# Altium schematic sheet Ethernet.SchDoc: Ethernet
size A4; Date: 01-DEC-2013; CompanyName: STMicroelectronics; Organization: Microcontrollers Division; Address1: 12, Rue Jules HOROWITZ; Address2: 38019 Grenoble; Address3: FRANCE; DocumentNumber: MB1272; Revision: A-01; SheetNumber: 12; SheetTotal: 15; Project: STM32MP15-DISCO PI
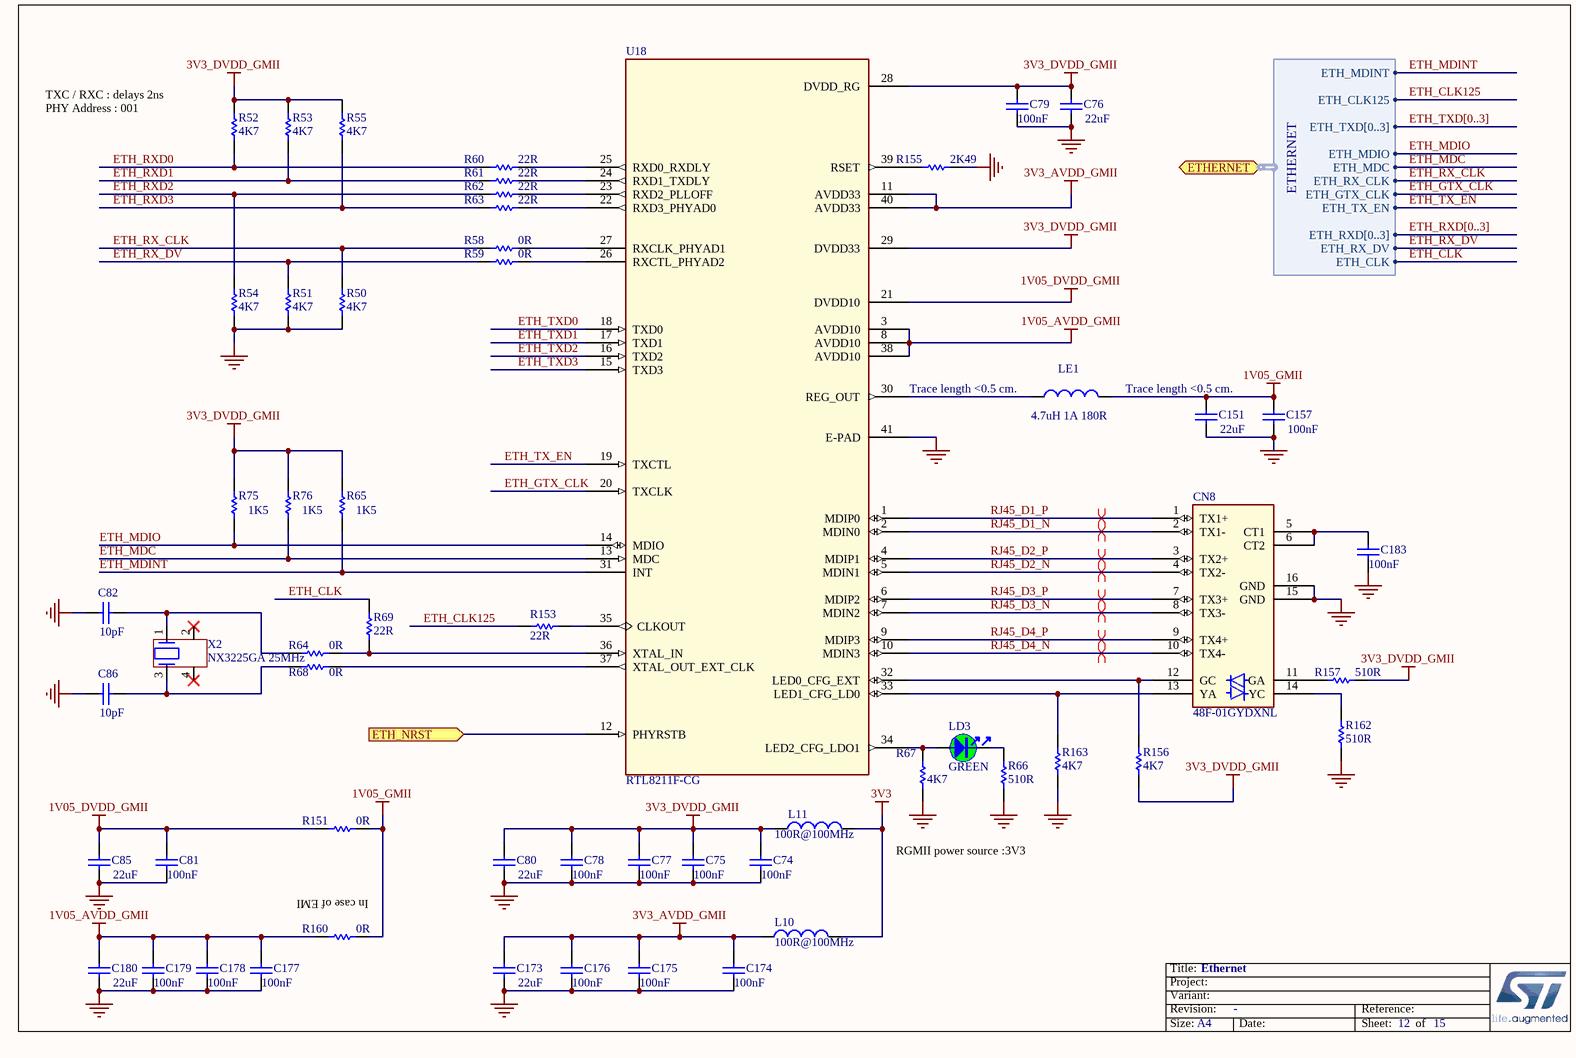
[diagram p0: Ethernet.SchDoc]

## Parts
C74  value 100nF  [C0402]
C75  value 100nF  [C0402]
C76  value 22uF  [C0603]
C77  value 100nF  [C0402]
C78  value 100nF  [C0402]
C79  value 100nF  [C0402]
C80  value 22uF  [C0603]
C81  value 100nF  [C0402]
C82  value 10pF  [C0402]
C85  value 22uF  [C0603]
C86  value 10pF  [C0402]
C151  value 22uF  [C0603]
C157  value 100nF  [C0402]
C173  value 22uF  [C0603]
C174  value 100nF  [C0402]
C175  value 100nF  [C0402]
C176  value 100nF  [C0402]
C177  value 100nF  [C0402]
C178  value 100nF  [C0402]
C179  value 100nF  [C0402]
C180  value 22uF  [C0603]
C183  value 100nF  [C0402]
CN8  value 48F-01GYDXNL  [CON_RJ45_YD_48F-01GYDXNL_LED-P]  (hidden comment: ​New part for use of led pulled down on pin 13/14 , schematic more lisible.)
L10  value 100R@100MHz  [FIL_0603_H0P65]
L11  value 100R@100MHz  [FIL_0603_H0P65]
LD3  value GREEN  [LED_0603_GREEN]
LE1  value 4.7uH 1A 180R  [L1210_LQH]
R50  value 4K7  [R0402]
R51  value 4K7  [R0402]
R52  value 4K7  [R0402]
R53  value 4K7  [R0402]
R54  value 4K7  [R0402]
R55  value 4K7  [R0402]
R58  value 0R  [R0402]
R59  value 0R  [R0402]
R60  value 22R  [R0402]
R61  value 22R  [R0402]
R62  value 22R  [R0402]
R63  value 22R  [R0402]
R64  value 0R  [R0402]
R65  value 1K5  [R0402]
R66  value 510R  [R0402]
R67  value 4K7  [R0402]
R68  value 0R  [R0402]
R69  value 22R  [R0402]
R75  value 1K5  [R0402]
R76  value 1K5  [R0402]
R151  value 0R  [R0603]
R153  value 22R  [R0402]
R155  value 2K49  [R0402]
R156  value 4K7  [R0402]
R157  value 510R  [R0402]
R160  value 0R  [R0603]
R162  value 510R  [R0402]
R163  value 4K7  [R0402]
U18  RTL8211F-CG  [ICC_QFN40-EPAD_5X5_P040]
X2  value NX3225GA 25MHz  [CRY_NX3225HA_4P]  (hidden comment: XTAL_4_PINS)

## Ports
ETH_NRST (in), ETHERNET (harness ETHERNET)

## Harnesses
ETHERNET: ETH_MDINT, ETH_CLK125, ETH_TXD[0..3], ETH_MDIO, ETH_MDC, ETH_RX_CLK, ETH_GTX_CLK, ETH_TX_EN, ETH_RXD[0..3], ETH_RX_DV, ETH_CLK

## Nets
1V05_AVDD_GMII: C177.2 C178.2 C179.2 C180.2 R160.1 U18.3(AVDD10) U18.8(AVDD10) U18.38(AVDD10)
1V05_DVDD_GMII: C81.2 C85.2 R151.1 U18.21(DVDD10)
1V05_GMII: C151.2 C157.2 LE1.2 R151.2 R160.2
3V3: L10.2 L11.2
3V3_AVDD_GMII: C173.2 C174.2 C175.2 C176.2 L10.1 U18.11(AVDD33) U18.40(AVDD33)
3V3_DVDD_GMII: C74.2 C75.2 C76.1 C77.2 C78.2 C79.2 C80.2 L11.1 R52.2 R53.2 R55.2 R65.2 R75.2 R76.2 R156.1 R157.2 U18.28(DVDD_RG) U18.29(DVDD33)
GND: C74.1 C75.1 C76.2 C77.1 C78.1 C79.1 C80.1 C81.1 C82.1 C85.1 C86.1 C151.1 C157.1 C173.1 C174.1 C175.1 C176.1 C177.1 C178.1 C179.1 C180.1 C183.1 CN8.15(GND) CN8.16(GND) R50.1 R51.1 R54.1 R66.1 R67.1 R155.2 R162.1 R163.1 U18.41(E-PAD)
ETH_CLK: R69.2 ; port ETHERNET.ETH_CLK
ETH_CLK125: R153.1 ; port ETHERNET.ETH_CLK125
ETH_GTX_CLK: U18.20(TXCLK) ; port ETHERNET.ETH_GTX_CLK
ETH_MDC: R76.1 U18.13(MDC) ; port ETHERNET.ETH_MDC
ETH_MDINT: R65.1 U18.31(INT) ; port ETHERNET.ETH_MDINT
ETH_MDIO: R75.1 U18.14(MDIO) ; port ETHERNET.ETH_MDIO
ETH_NRST: U18.12(PHYRSTB) ; port ETH_NRST
ETH_RX_CLK: R50.2 R58.1 ; port ETHERNET.ETH_RX_CLK
ETH_RX_DV: R51.2 R59.1 ; port ETHERNET.ETH_RX_DV
ETH_RXD0: R52.1 R60.1
ETH_RXD1: R53.1 R61.1
ETH_RXD2: R54.2 R62.1
ETH_RXD3: R55.1 R63.1
ETH_TX_EN: U18.19(TXCTL) ; port ETHERNET.ETH_TX_EN
ETH_TXD0: U18.18(TXD0)
ETH_TXD1: U18.17(TXD1)
ETH_TXD2: U18.16(TXD2)
ETH_TXD3: U18.15(TXD3)
RJ45_D1_N: CN8.2(TX1-) U18.2(MDIN0)
RJ45_D1_P: CN8.1(TX1+) U18.1(MDIP0)
RJ45_D2_N: CN8.4(TX2-) U18.5(MDIN1)
RJ45_D2_P: CN8.3(TX2+) U18.4(MDIP1)
RJ45_D3_N: CN8.8(TX3-) U18.7(MDIN2)
RJ45_D3_P: CN8.7(TX3+) U18.6(MDIP2)
RJ45_D4_N: CN8.10(TX4-) U18.10(MDIN3)
RJ45_D4_P: CN8.9(TX4+) U18.9(MDIP3)
NetC82_2: C82.2 R64.1 X2.1
NetC86_2: C86.2 R68.1 X2.3
NetC183_2: C183.2 CN8.5(CT1) CN8.6(CT2)
NetCN8_11: CN8.11(GA) R157.1
NetCN8_12: CN8.12(GC) R156.2 U18.32(LED0_CFG_EXT)
NetCN8_13: CN8.13(YA) R163.2 U18.33(LED1_CFG_LD0)
NetCN8_14: CN8.14(YC) R162.2
NetLD3_1: LD3.1 R67.2 U18.34(LED2_CFG_LDO1)
NetLD3_2: LD3.2 R66.2
NetLE1_1: LE1.1 U18.30(REG_OUT)
NetR58_2: R58.2 U18.27(RXCLK_PHYAD1)
NetR59_2: R59.2 U18.26(RXCTL_PHYAD2)
NetR60_2: R60.2 U18.25(RXD0_RXDLY)
NetR61_2: R61.2 U18.24(RXD1_TXDLY)
NetR62_2: R62.2 U18.23(RXD2_PLLOFF)
NetR63_2: R63.2 U18.22(RXD3_PHYAD0)
NetR64_2: R64.2 R69.1 U18.36(XTAL_IN)
NetR68_2: R68.2 U18.37(XTAL_OUT_EXT_CLK)
NetR153_2: R153.2 U18.35(CLKOUT)
NetR155_1: R155.1 U18.39(RSET)

Not connected (* = marked no-connect by the designer): X2 2* 4*

## Buses and harness runs
bus ETH_RXD[0..3]
bus ETH_TXD[0..3]

## Layout directives
differential pair: RJ45_D1_N, RJ45_D1_P, RJ45_D2_N, RJ45_D2_P, RJ45_D3_N, RJ45_D3_P, RJ45_D4_N, RJ45_D4_P

## Notes on the sheet
- (near R52) TXC / RXC : delays 2ns
  PHY Address : 001
- (near LE1) Trace length <0.5 cm.
- (near C151) Trace length <0.5 cm.
- (near R160) In case of EMI
- RGMII power source :3V3
- Title:
- Project:
- Size:
- Revision:
- Variant:
- A4
- -
- Date:
- Reference:
- Sheet:
- of

## Library data of the parts
C74 C75 C77-C79 C81 C157 C174-C179 C183 = MCD-00006: Capacitor,100nF,16V,X7R,10%,0402; Manufacturer_Part_Number: CC0402KRX7R7BB104; Manufacturer: YAGEO; Alternate_Manufacturer: MURATA; Alternate_Manufacturer_Part_Number: GCM155R71C104KA55D; Provided_By: SUBCO; Initial_Board_Reference: mb1274; Internal_Part_Number: MCD-00006; ComponentLink1Description: Datasheet; ECCN_US: n/a; ECCN_EU: n/a; Status: Released; Part_Type: Capacitor; Package: C0402; ComponentLink1URL: http://tunmcdsvn.tun.st.com/Component_Datasheet_Library/Trunk/Capacitors/Yageo_Multilayer_Capacitor_X7R_series_100pF_to_22uF
C76 C80 C85 C151 C173 C180 = MCD-00100: Capacitor,22uF,6V3,X5R,20%,0603; Manufacturer_Part_Number: GRM188R60J226MEA0J; Manufacturer: MURATA; ECCN_US: EAR99; ECCN_EU: NEC; Provided_By: SUBCO; Initial_Board_Reference: mb1262; Internal_Part_Number: MCD-00100; ComponentLink1Description: Datasheet; Status: Released; Part_Type: Capacitor; Package: C0603; ComponentLink1URL: http://tunmcdsvn.tun.st.com/Component_Datasheet_Library/Trunk/Capacitors/Murata_Capacitor_GR_series
C82 C86 = MCD-00015: Capacitor,10pF,50V,NPO,5%,0402; Manufacturer_Part_Number: CC0402JRNPO9BN100; Manufacturer: YAGEO; Provided_By: SUBCO; Initial_Board_Reference: mb1274; Internal_Part_Number: MCD-00015; ComponentLink1Description: Datasheet; ECCN_US: n/a; ECCN_EU: n/a; Status: Released; Part_Type: Capacitor; Package: C0402; ComponentLink1URL: http://tunmcdsvn.tun.st.com/Component_Datasheet_Library/Trunk/Capacitors/Yageo_Capacitor_NP0_16V-to-50V
CN8 = MCD-01129: Connector RJ45 with Gigabit magnetics and LED , led pull down; Manufacturer: YUAN DEAN SCIENTIFIC; Provided_By: SUBCO; Initial_Board_Reference: MB1272; Internal_Part_Number: MCD-01129; Manufacturer_Part_Number: 48F-01GYDXNL; ComponentLink1Description: Datasheet; Status: Footprint available; Part_Type: Connector; ECCN_US: n/a; ECCN_EU: n/a; ComponentLink1URL: http://tunmcdsvn.tun.st.com/Component_Datasheet_Library/Trunk/Connectors/YuanDean_RJ45_48Fseries/
L10 L11 = MCD-00094: Ferrite bead 100R 2A 0603; Manufacturer_Part_Number: BLM18EG101TN1; Manufacturer: MURATA; Part_Type: Inductor; ECCN_US: EAR99; ECCN_EU: NEC; Provided_By: SUBCO; Initial_Board_Reference: mb1262; Internal_Part_Number: MCD-00094; ComponentLink1Description: Datasheet; Status: Released; ComponentLink1URL: http://tunmcdsvn.tun.st.com/Component_Datasheet_Library/Trunk/Inductors/Murata_EMI_Filters_BLM
LD3 = MCD-00050: LED, Green, 0603; Manufacturer_Part_Number: 19-213SYGC/S530-E2/TR8; Manufacturer: EVERLIGHT; Part_Type: Display; ECCN_US: EAR99; ECCN_EU: NEC; Provided_By: SUBCO; Initial_Board_Reference: mb1274; Internal_Part_Number: MCD-00050; ComponentLink1Description: Datasheet; Status: Released; ComponentLink1URL: http://tunmcdsvn.tun.st.com/Component_Datasheet_Library/Trunk/Display/Everlight_SMD-LED-GREEN_19-213SYGC-S530-XX-TR8-v3.doc; Package: LED 0603
LE1 = MCD-00048: FIXED IND 4.7UH 1A 180 MOHM 30% SMD; Manufacturer_Part_Number: LQH32PN4R7NN0L; Manufacturer: MURATA; Provided_By: SUBCO; Initial_Board_Reference: mb1274; Internal_Part_Number: MCD-00048; ComponentLink1Description: Datasheet; ECCN_US: n/a; ECCN_EU: n/a; Status: Released; Part_Type: Inductor; ComponentLink1URL: http://tunmcdsvn.tun.st.com/Component_Datasheet_Library/Trunk/Inductors/Murata_Inductor_LQH32PN4R7NN0L
R50-R55 R67 R156 R163 = MCD-00065: Resistor,4K7,0402,1%,1/16W; Manufacturer_Part_Number: RC0402FR-074K7L; Manufacturer: YAGEO; Alternate_Manufacturer_Part_Number: RT0402FRE074K7L; Provided_By: SUBCO; Initial_Board_Reference: mb1274; Internal_Part_Number: MCD-00065; Alternate_Manufacturer: YAGEO; ComponentLink1Description: Datasheet; ECCN_US: n/a; ECCN_EU: n/a; Status: Released; Part_Type: Resistor; ComponentLink1URL: http://tunmcdsvn.tun.st.com/Component_Datasheet_Library/Trunk/Resistors/Yageo_Resistor_RC0402-series; Package: R0402
R58 R59 R64 R68 = MCD-00052: Resistor,0R,0402,5%,1/16W; Manufacturer_Part_Number: RC0402JR-070RL; Manufacturer: YAGEO; Provided_By: SUBCO; Initial_Board_Reference: mb1274; Internal_Part_Number: MCD-00052; ComponentLink1Description: Datasheet; ECCN_US: n/a; ECCN_EU: n/a; Status: Released; Part_Type: Resistor; ComponentLink1URL: http://tunmcdsvn.tun.st.com/Component_Datasheet_Library/Trunk/Resistors/Yageo_Resistor_RC0402-series; Package: R0402
R60-R63 R69 R153 = MCD-00189: Resistor,22R,0402,1%,1/16W; Manufacturer_Part_Number: RC0402FR-0722RL; Manufacturer: YAGEO; Provided_By: SUBCO; Internal_Part_Number: MCD-00189; ComponentLink1Description: Datasheet; ECCN_US: n/a; ECCN_EU: n/a; Status: Released; Part_Type: Resistor; ComponentLink1URL: http://tunmcdsvn.tun.st.com/Component_Datasheet_Library/Trunk/Resistors/Yageo_Resistor_RC0402-series; Package: R0402
R65 R75 R76 = MCD-00068: Resistor,1K5,0402,1%,1/16W; Manufacturer_Part_Number: RC0402FR-071K5L; Manufacturer: YAGEO; Provided_By: SUBCO; Initial_Board_Reference: mb1274; Internal_Part_Number: MCD-00068; ComponentLink1Description: Datasheet; ECCN_US: n/a; ECCN_EU: n/a; Status: Released; Part_Type: Resistor; ComponentLink1URL: http://tunmcdsvn.tun.st.com/Component_Datasheet_Library/Trunk/Resistors/Yageo_Resistor_RC0402-series; Package: R0402
R66 R157 R162 = MCD-00064: Resistor,510R,0402,1%,1/16W; Manufacturer_Part_Number: RC0402FR-07510RL; Manufacturer: YAGEO; Provided_By: SUBCO; Initial_Board_Reference: mb1274; Internal_Part_Number: MCD-00064; ComponentLink1Description: Datasheet; ECCN_US: n/a; ECCN_EU: n/a; Status: Released; Part_Type: Resistor; ComponentLink1URL: http://tunmcdsvn.tun.st.com/Component_Datasheet_Library/Trunk/Resistors/Yageo_Resistor_RC0402-series; Package: R0402
R151 R160 = MCD-00056: Resistor,0R,0603,5%,1/10W; Manufacturer_Part_Number: RC0603JR-070RL; Manufacturer: YAGEO; Provided_By: SUBCO; Initial_Board_Reference: mb1274; Internal_Part_Number: MCD-00056; ComponentLink1Description: Datasheet; ECCN_US: n/a; ECCN_EU: n/a; Status: Released; Part_Type: Resistor; ComponentLink1URL: http://tunmcdsvn.tun.st.com/Component_Datasheet_Library/Trunk/Resistors/Yageo_Resistor_RC0603-series; Package: R0603
R155 = MCD-00183: Resistor,2K49,0402,1%,1/16W; Manufacturer_Part_Number: RC0402FR-072K49L; Manufacturer: YAGEO; Provided_By: SUBCO; Internal_Part_Number: MCD-00183; ComponentLink1Description: Datasheet; ECCN_US: n/a; ECCN_EU: n/a; Status: Released; Part_Type: Resistor; ComponentLink1URL: http://tunmcdsvn.tun.st.com/Component_Datasheet_Library/Trunk/Resistors/Yageo_Resistor_RC0402-series; Package: R0402
U18 = MCD-01130: 10/100/1000M GIGABIT Ethernet Transceiver, QFN40 , SMPS version; Manufacturer: REALTEK; Part_Type: IC; Provided_By: SUBCO; Initial_Board_Reference: MB1272; Value: RTL8211F-CG; Internal_Part_Number: MCD-01130; Manufacturer_Part_Number: RTL8211F-CG; ComponentLink1Description: Datasheet; ComponentLink1URL: http://tunmcdsvn.tun.st.com/Component_Datasheet_Library/Trunk/IC/REALTEK_RTL8211F_RGMII_phy; Status: Checked; ECCN_US: n/a; ECCN_EU: n/a
X2 = MCD-01463: Crystal 25Mhz, 10pF, -+50PPM, SMD; Part_Type: Crystal_Osc; Manufacturer_Part_Number: NX3225GA 25MHz EXS00A-CG06750; Manufacturer: NDK; Provided_By: SUBCO; Initial_Board_Reference: MB1272B; Remark: footprint same as CRY_NX3225HA_4P; Internal_Part_Number: MCD-01463; Status: Footprint available; Package: 3225; ComponentLink1Description: Datasheet; ComponentLink1URL: http://tunmcdsvn.tun.st.com/Component_Datasheet_Library/Trunk/Crystal_Osc/NDK_NX3225GA 25Mhz  EXS00A-CG06750/NDK_NX3225GA 25MHz EXS00A-CG06750.pdf